# EAGLE design RGB-LED (EAGLE 7.2.0)
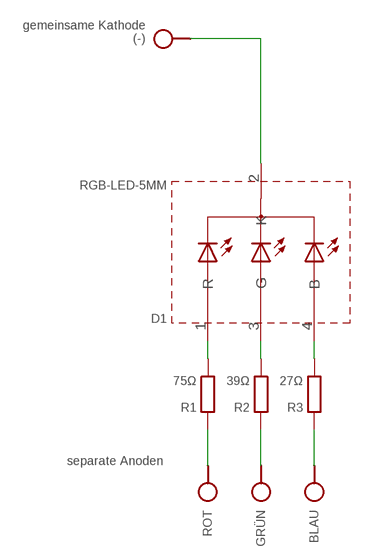
[diagram p0: schematic, sheet 1]

## Parts
(-)  HPORT  [SPAD]
BLAU  HPORT  [SPAD]
D1  RGB-LED-5MM  [LED5MM]
GRÜN  HPORT  [SPAD]
R1  75Ω  R0204/12-V  [0204/12-V]
R2  39Ω  R0204/12-V  [0204/12-V]
R3  27Ω  R0204/12-V  [0204/12-V]
ROT  HPORT  [SPAD]

## Nets
N$1: D1.1(R) R1.2
N$2: D1.3(G) R2.2
N$3: D1.4(B) R3.2
N$4: R1.1 ROT.1
N$5: GRÜN.1 R2.1
N$6: BLAU.1 R3.1
N$7: (-).1 D1.2(K)

## Notes on the sheet
- gemeinsame Kathode
- separate Anoden

## Library data of the parts
(-) BLAU GRÜN ROT = pad:HPORT
D1 = d:RGB-LED
R1-R3 = r:R: RESISTOR, European symbol

## Board
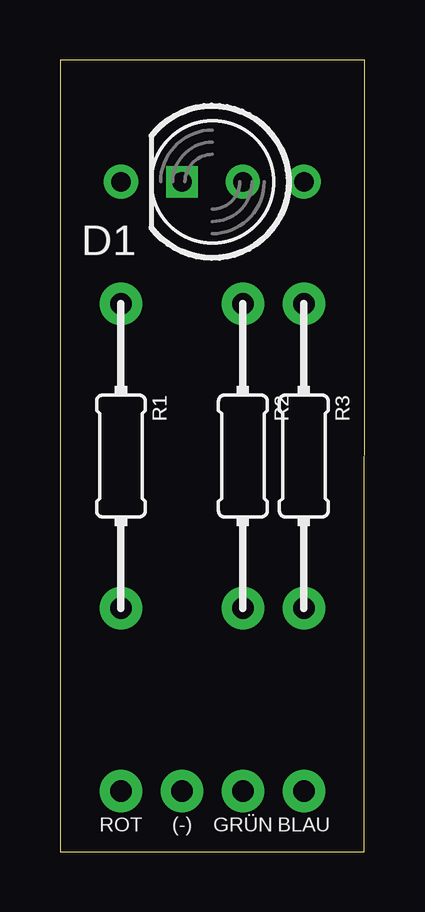
[diagram p1: board, top side]
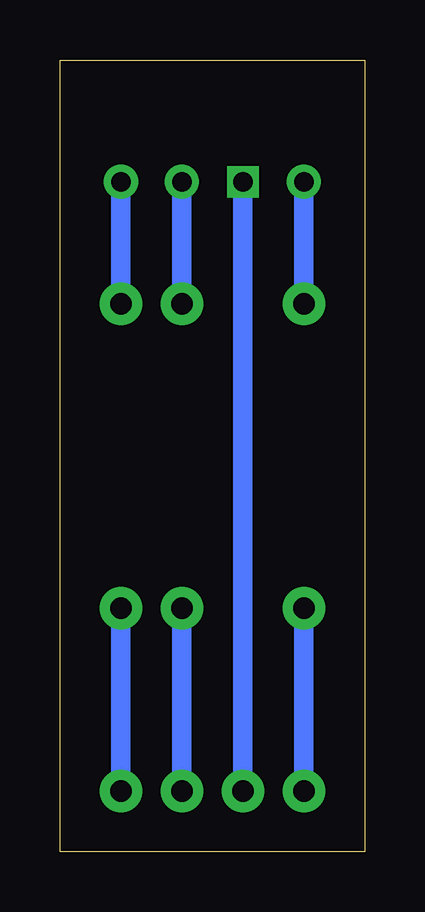
[diagram p2: board, bottom side, seen from below]

Size 12.7 x 33.02 mm. Coordinates in mm from the lower left corner, seen from the top.
Outline: 0,0 12.68,0 12.7,33.02 0,33.02 0,0
Copper layers (1*16): Top 0.035mm / dielectric 1.5mm / Bottom 0.035mm
Design rules "default": minimum track width 10mil, minimum drill 24mil, track to track 8mil, track to pad 8mil, pad to pad 8mil, via to via 8mil, smd to smd 8mil, copper to edge 40mil, drill to drill 8mil, minimum pad ring 10mil, minimum via ring 8mil, stop-mask expansion 4mil, vias tented up to drill 0mil, thermal gap 10mil

### Footprints (pad centres in the part's own frame; a part is rotated, then mirrored left to right if it is on the bottom)
SPAD = drill 0.9 pad 1.778: 1 0,0
LED5MM = drill 0.813 pad 1.422: 1 3.81,0; 3 -1.27,0; 4 -3.81,0 | drill 0.813 square: 2 1.27,0
0204/12-V = drill 0.9 pad 1.778: 1 0,6.35; 2 0,-6.35

### Placement (x,y rotation side)
(-)  5.08,2.54 90 top
BLAU  10.16,2.54 90 top
D1  6.35,27.94 180 top
GRÜN  7.62,2.54 90 top
R1  2.54,16.51 180 top
R2  7.62,16.51 180 top
R3  10.16,16.51 180 top
ROT  2.54,2.54 90 top

### Tracks (layer width: path | path; a pad name or v marks a point on that pad's centre or on a via)
N$1
  Bottom 0.813: R1.2 D1.1
N$2
  Bottom 0.813: R2.2 D1.3
N$3
  Bottom 0.813: D1.4 R3.2
N$4
  Bottom 0.813: R1.1 ROT.1
N$5
  Bottom 0.813: R2.1 GRÜN.1
N$6
  Bottom 0.813: R3.1 BLAU.1
N$7
  Bottom 0.813: (-).1 D1.2